# Altium schematic sheet LLA1305.SchDoc
size A4; SheetNumber: 1; SheetTotal: 11
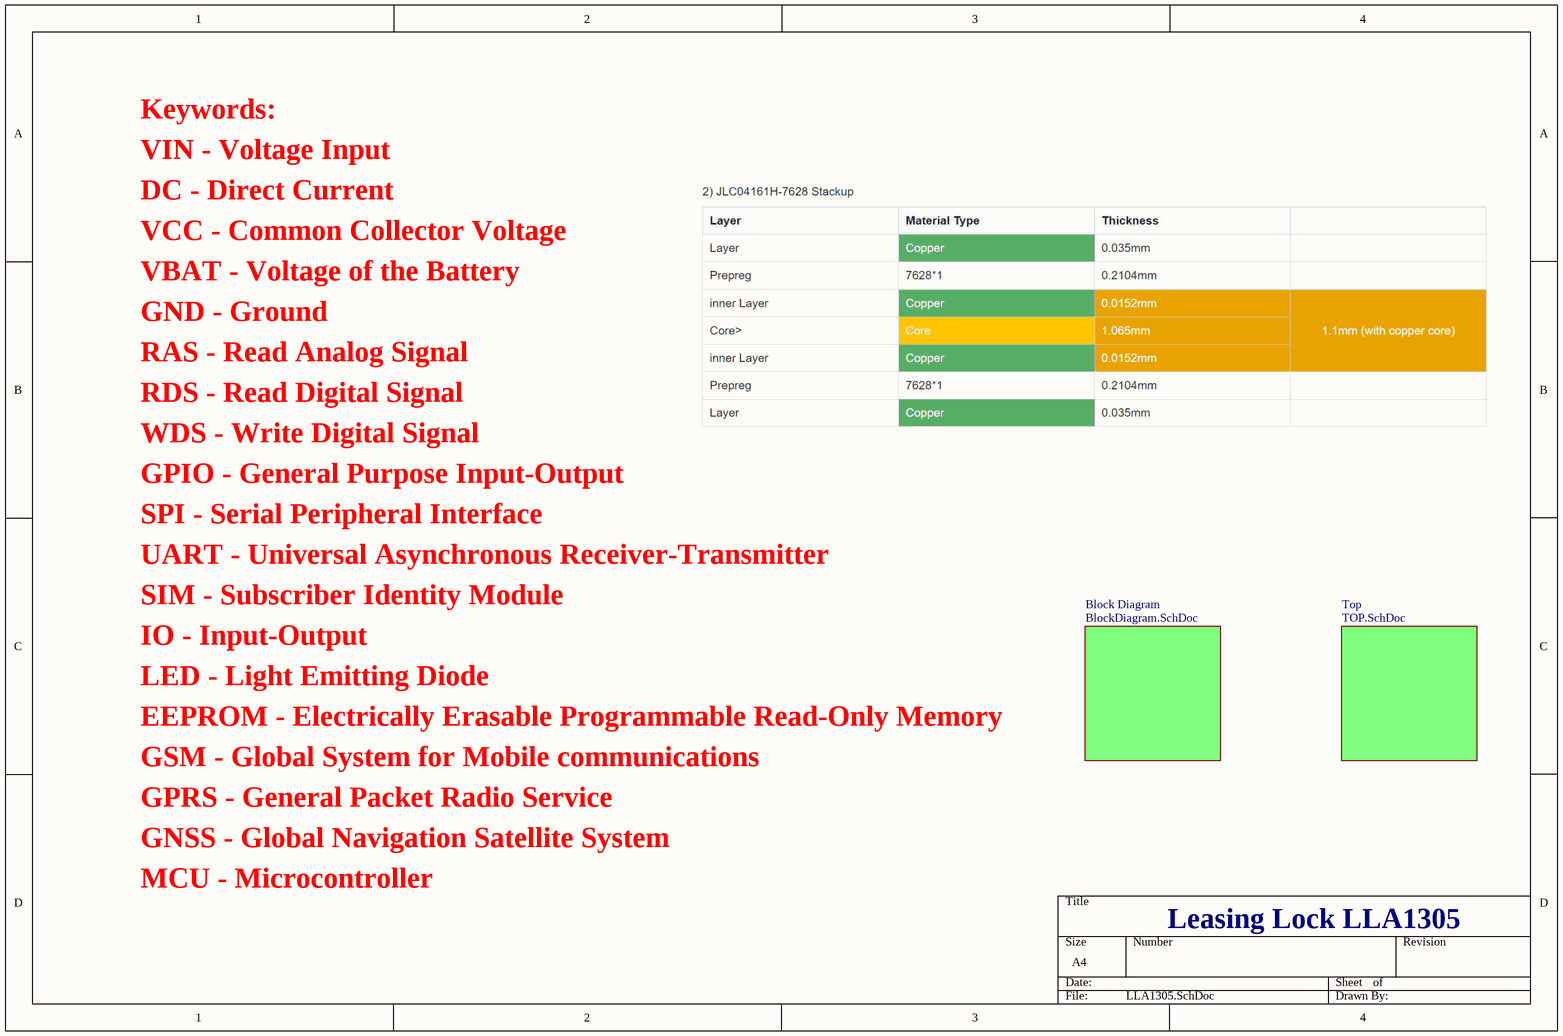
[diagram p0: LLA1305.SchDoc]

## Sub-sheets
Block Diagram = BlockDiagram.SchDoc: no entries
Top = TOP.SchDoc: no entries

## Notes on the sheet
- Keywords:
- VIN - Voltage Input
- DC - Direct Current
- VCC - Common Collector Voltage
- VBAT - Voltage of the Battery
- RAS - Read Analog Signal
- GND - Ground
- RDS - Read Digital Signal
- WDS - Write Digital Signal
- GPIO - General Purpose Input-Output
- SPI - Serial Peripheral Interface
- UART - Universal Asynchronous Receiver-Transmitter
- SIM - Subscriber Identity Module
- IO - Input-Output
- LED - Light Emitting Diode
- EEPROM - Electrically Erasable Programmable Read-Only Memory
- GSM - Global System for Mobile communications
- GPRS - General Packet Radio Service
- GNSS - Global Navigation Satellite System
- MCU - Microcontroller
- Leasing Lock LLA1305